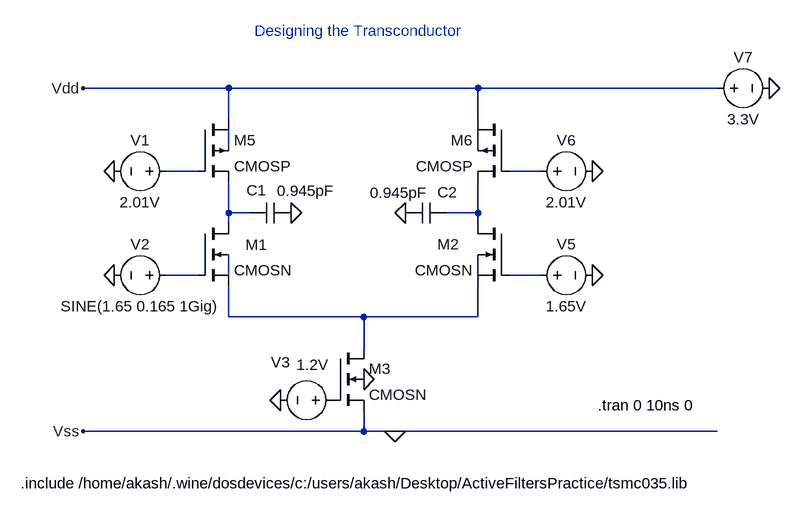
[diagram p0: schematic Transconductor.asc]
Transconductor.asc, the LTspice schematic file:
Version 4
SHEET 1 884 680
WIRE 32 -48 -192 -48
WIRE 416 -48 32 -48
WIRE 784 -48 416 -48
WIRE 32 0 32 -48
WIRE 416 0 416 -48
WIRE 32 48 32 16
WIRE 416 48 416 16
WIRE -16 80 -64 80
WIRE 512 80 464 80
WIRE 32 144 32 96
WIRE 64 144 32 144
WIRE 416 144 416 96
WIRE 416 144 368 144
WIRE 32 160 32 144
WIRE 416 160 416 144
WIRE -16 240 -64 240
WIRE 32 240 32 208
WIRE 416 240 416 208
WIRE 512 240 464 240
WIRE 32 304 32 256
WIRE 240 304 32 304
WIRE 416 304 416 256
WIRE 416 304 240 304
WIRE 240 352 240 304
WIRE 240 480 240 448
WIRE 240 480 -192 480
WIRE 288 480 240 480
WIRE 784 480 288 480
FLAG 288 480 0
FLAG -192 -48 Vdd
FLAG -192 480 Vss
FLAG -144 80 0
FLAG -144 240 0
FLAG 592 240 0
FLAG 592 80 0
FLAG 864 -48 0
FLAG 240 400 0
FLAG 112 432 0
FLAG 128 144 0
FLAG 304 144 0
SYMBOL nmos4 -16 160 R0
WINDOW 0 74 33 Left 2
SYMATTR InstName M1
SYMATTR Value CMOSN
SYMATTR Value2 l=0.5u w=21u
SYMBOL nmos4 464 160 M0
WINDOW 0 77 32 Left 2
SYMATTR InstName M2
SYMATTR Value CMOSN
SYMATTR Value2 l=0.5u w=21u
SYMBOL pmos4 -16 0 R0
SYMATTR InstName M5
SYMATTR Value CMOSP
SYMATTR Value2 l=0.5u w=50u
SYMBOL pmos4 464 0 M0
SYMATTR InstName M6
SYMATTR Value CMOSP
SYMATTR Value2 l=0.5u w=50u
SYMBOL voltage -48 80 R90
WINDOW 0 -32 56 VBottom 2
WINDOW 3 32 56 VTop 2
SYMATTR InstName V1
SYMATTR Value 2.01V
SYMBOL voltage -48 240 R90
WINDOW 0 -32 56 VBottom 2
WINDOW 3 32 56 VTop 2
WINDOW 123 60 56 VTop 2
WINDOW 39 0 0 Left 0
SYMATTR InstName V2
SYMATTR Value SINE(1.65 0.165 1Gig)
SYMBOL voltage 496 240 M90
WINDOW 0 -32 56 VBottom 2
WINDOW 3 32 56 VTop 2
SYMATTR InstName V5
SYMATTR Value 1.65V
SYMBOL voltage 496 80 M90
WINDOW 0 -32 56 VBottom 2
WINDOW 3 32 56 VTop 2
SYMATTR InstName V6
SYMATTR Value 2.01V
SYMBOL voltage 768 -48 M90
WINDOW 0 -32 56 VBottom 2
WINDOW 3 32 56 VTop 2
WINDOW 123 0 0 Left 0
WINDOW 39 0 0 Left 0
SYMATTR InstName V7
SYMATTR Value 3.3V
SYMBOL nmos4 192 352 R0
SYMATTR InstName M3
SYMATTR Value CMOSN
SYMATTR Value2 l=0.5u w=100u
SYMBOL voltage 208 432 R90
WINDOW 0 -43 96 VBottom 2
WINDOW 3 -70 47 VTop 2
WINDOW 123 0 0 Left 0
WINDOW 39 0 0 Left 0
SYMATTR InstName V3
SYMATTR Value 1.2V
SYMBOL cap 128 128 R90
WINDOW 0 -3 53 VBottom 2
WINDOW 3 -34 -23 VTop 2
SYMATTR InstName C1
SYMATTR Value 0.945pF
SYMBOL cap 368 128 R90
WINDOW 0 0 -1 VBottom 2
WINDOW 3 -31 74 VTop 2
SYMATTR InstName C2
SYMATTR Value 0.945pF
TEXT -288 560 Left 2 !.include /home/akash/.wine/dosdevices/c:/users/akash/Desktop/ActiveFiltersPractice/tsmc035.lib
TEXT 72 -136 Left 2 ;Designing the Transconductor
TEXT 600 440 Left 2 !.tran 0 10ns 0

The netlist it stands for:
* Transconductor.asc
M1 N005 N007 N011 N008 CMOSN l=0.5u w=21u
M2 N006 N010 N011 N009 CMOSN l=0.5u w=21u
M5 Vdd N003 N005 N001 CMOSP l=0.5u w=50u
M6 Vdd N004 N006 N002 CMOSP l=0.5u w=50u
V1 N003 0 2.01V
V2 N007 0 SINE(1.65 0.165 1Gig)
V5 N010 0 1.65V
V6 N004 0 2.01V
V7 Vdd 0 3.3V
M3 N011 P001 0 0 CMOSN l=0.5u w=100u
V3 P001 0 1.2V
C1 0 N005 0.945pF
C2 N006 0 0.945pF
.model NMOS NMOS
.model PMOS PMOS
.lib standard.mos
.include /home/akash/.wine/dosdevices/c:/users/akash/Desktop/ActiveFiltersPractice/tsmc035.lib
* Designing the Transconductor
.tran 0 10ns 0
.backanno
.end